# Altium schematic sheet IO_SCH3.SchDoc
size B; Organization: CWRUbotix; Address1: 10900 Euclid Avenue; Address2: Cleveland, OH 44106; Address3: USA
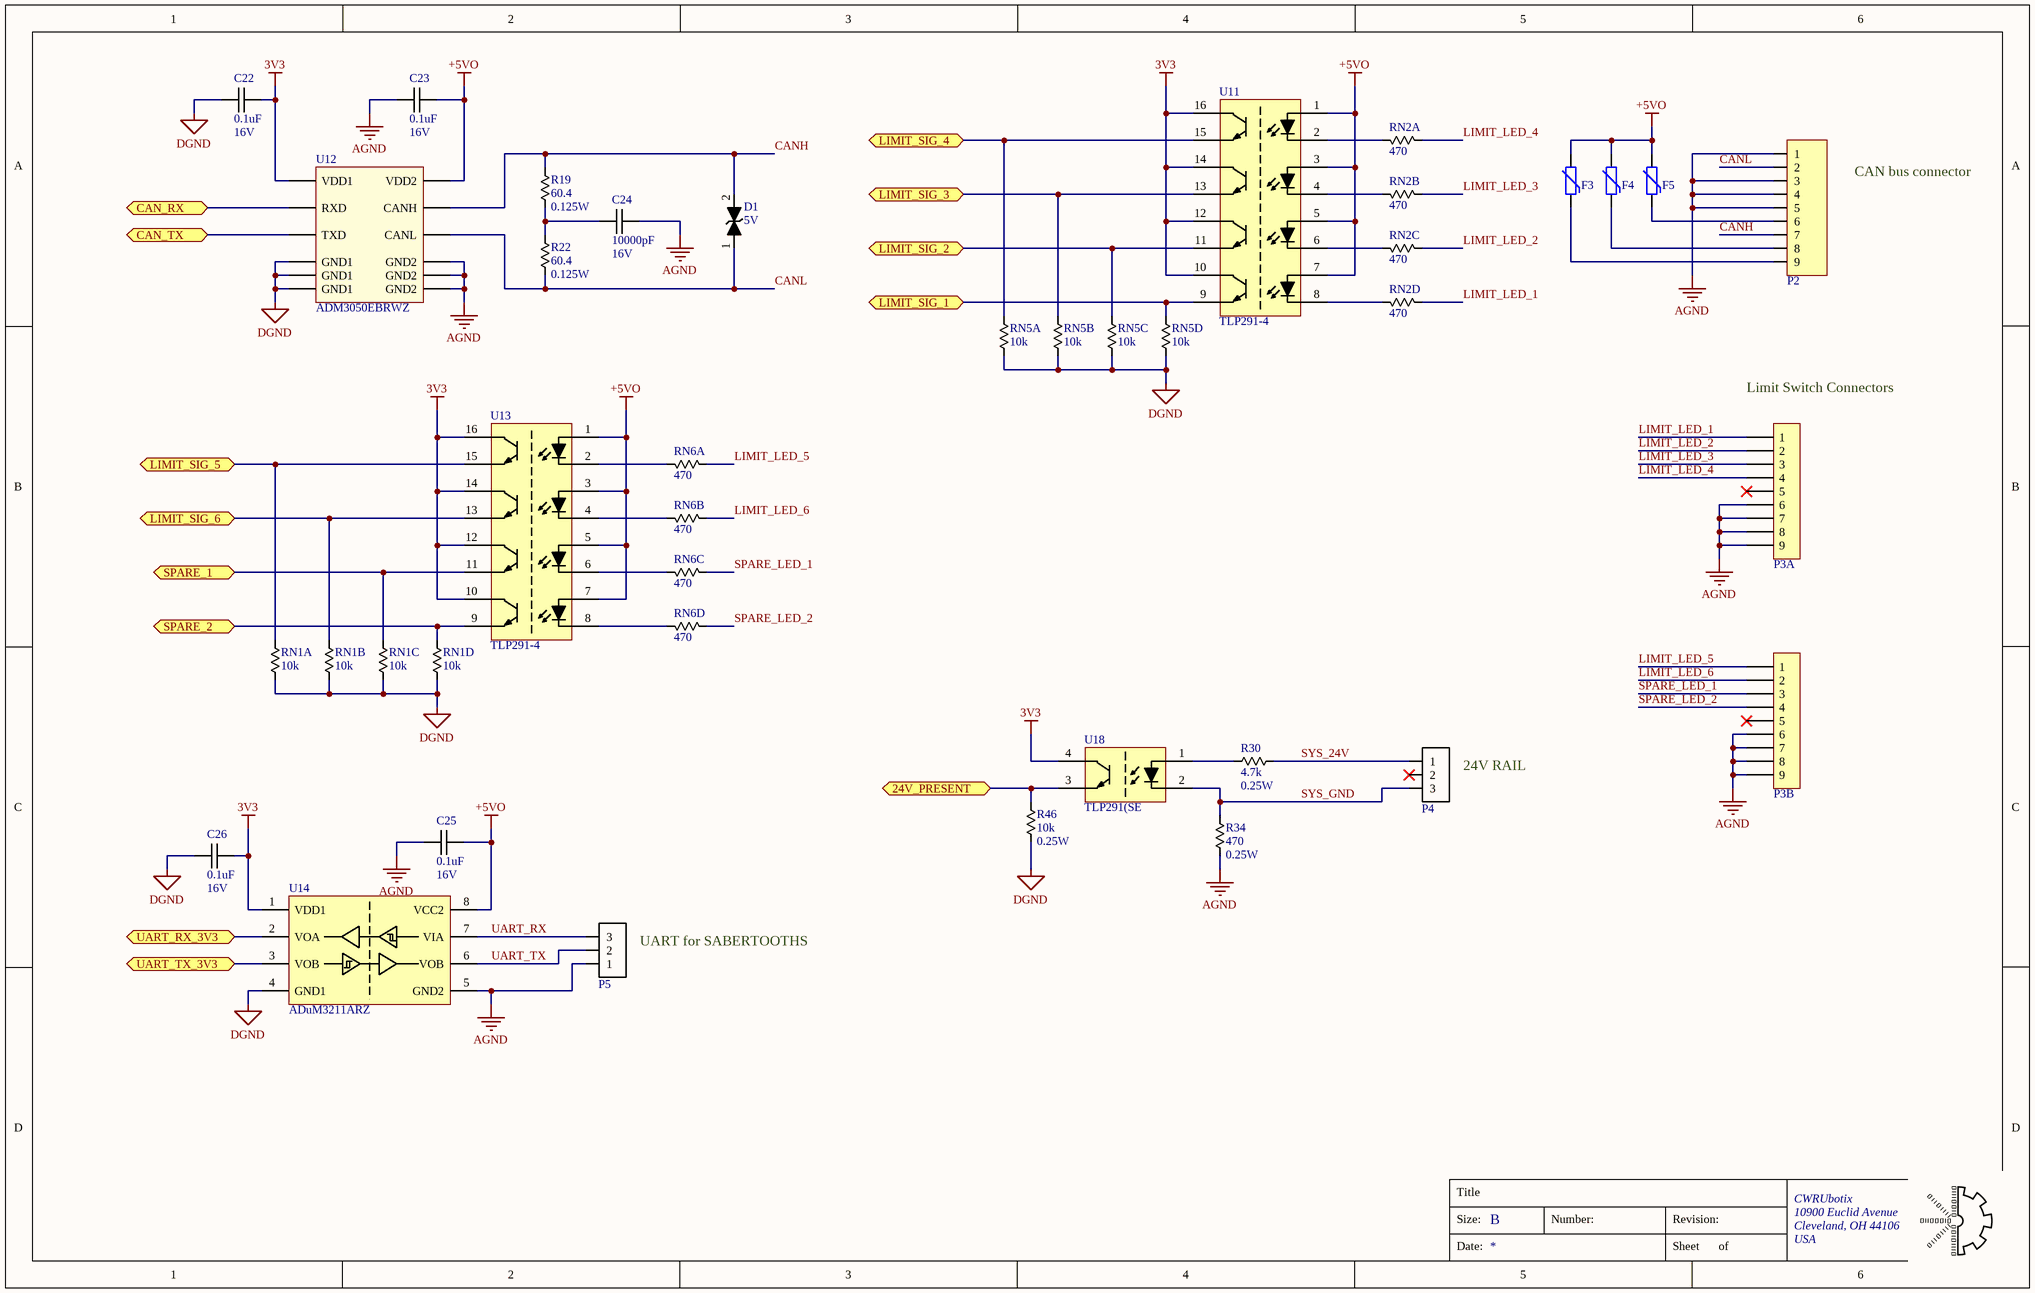
[diagram p0: IO_SCH3.SchDoc]

## Parts
C22  Capacitance: 0.1uF  Voltage Rating: 16V  [chip_0603]  (hidden comment: cap_single_np)
C23  Capacitance: 0.1uF  Voltage Rating: 16V  [chip_0603]  (hidden comment: cap_single_np)
C24  Capacitance: 10000pF  Voltage Rating: 16V  [chip_0603]  (hidden comment: cap_single_np)
C25  Capacitance: 0.1uF  Voltage Rating: 16V  [chip_0603]  (hidden comment: cap_single_np)
C26  Capacitance: 0.1uF  Voltage Rating: 16V  [chip_0603]  (hidden comment: cap_single_np)
D1  Reverse Breakdown Voltage: 5V  [do-214ac]  (hidden comment: diode_5)
F3  PTC_0  [chip_1206]  (value not drawn)
F4  PTC_0  [chip_1206]  (value not drawn)
F5  PTC_0  [chip_1206]  (value not drawn)
P2  conn-9x1_0  [182-009-213RYY1]  (value not drawn)
P3  conn-9x1_x2  [D_SUB_9x2_0]  (value not drawn)  (parts A,B of 2)
P4  conn-3x1_0  [JST_PHR_3_0]  (value not drawn)
P5  conn-3x1_0  [JST_PHR_3_0]  (value not drawn)
R19  Resistance: 60.4  Power Rating: 0.125W  [chip_0805]  (hidden comment: res_single)
R22  Resistance: 60.4  Power Rating: 0.125W  [chip_0805]  (hidden comment: res_single)
R30  Resistance: 4.7k  Power Rating: 0.25W  [chip_0603]  (hidden comment: res_single)
R34  Resistance: 470  Power Rating: 0.25W  [chip_0603]  (hidden comment: res_single)
R46  Resistance: 10k  Power Rating: 0.25W  [chip_0603]  (hidden comment: res_single)
RN1  Resistance: 10k  [chip_1206_arr]  (hidden comment: res_array_4)  (parts A,B,C,D of 4)
RN2  Resistance: 470  [chip_1206_arr]  (hidden comment: res_array_4)  (parts A,B,C,D of 4)
RN5  Resistance: 10k  [chip_1206_arr]  (hidden comment: res_array_4)  (parts A,B,C,D of 4)
RN6  Resistance: 470  [chip_1206_arr]  (hidden comment: res_array_4)  (parts A,B,C,D of 4)
U11  TLP291-4  [SO-16]
U12  Manufacturer PN: ADM3050EBRWZ  [SOW-16]  (hidden comment: ADM3050E)
U13  TLP291-4  [SO-16]
U14  Manufacturer PN: ADuM3211ARZ  [SO-8]  (hidden comment: ADuM3211)
U18  Manufacturer PN: TLP291(SE  [SO-4]  (hidden comment: opto_0)

## Ports
24V_PRESENT (bidir), CAN_RX (bidir), CAN_TX (bidir), LIMIT_SIG_1 (bidir), LIMIT_SIG_2 (bidir), LIMIT_SIG_3 (bidir), LIMIT_SIG_4 (bidir), LIMIT_SIG_5 (bidir), LIMIT_SIG_6 (bidir), SPARE_1 (bidir), SPARE_2 (bidir), UART_RX_3V3 (bidir), UART_TX_3V3 (bidir)

## Nets
3V3: C22.2 C26.2 U11.10 U11.12 U11.14 U11.16 U12.1(VDD1) U13.10 U13.12 U13.14 U13.16 U14.1(VDD1) U18.4(C)
+5VO: C23.1 C25.2 F3.2 F4.2 F5.2 U11.1 U11.3 U11.5 U11.7 U12.16(VDD2) U13.1 U13.3 U13.5 U13.7 U14.8(VCC2)
AGND: C23.2 C24.1 C25.1 P2.1 P2.3 P2.4 P2.5 P3.6 P3.7 P3.8 P3.9 P3.15(6) P3.16(7) P3.17(8) P3.18(9) P5.1 R34.1 U12.9(GND2) U12.10(GND2) U12.15(GND2) U14.5(GND2)
DGND: C22.1 C26.1 R46.2 RN1.5 RN1.6 RN1.7 RN1.8 RN5.5 RN5.6 RN5.7 RN5.8 U12.2(GND1) U12.7(GND1) U12.8(GND1) U14.4(GND1)
24V_PRESENT: R46.1 U18.3(E) ; port 24V_PRESENT
CAN_RX: U12.3(RXD) ; port CAN_RX
CAN_TX: U12.6(TXD) ; port CAN_TX
CANH: D1.2 P2.7 R19.1 U12.13(CANH)
CANL: D1.1 P2.2 R22.2 U12.12(CANL)
LIMIT_LED_1: P3.1 RN2.4
LIMIT_LED_2: P3.2 RN2.3
LIMIT_LED_3: P3.3 RN2.2
LIMIT_LED_4: P3.4 RN2.1
LIMIT_LED_5: P3.10(1) RN6.1
LIMIT_LED_6: P3.11(2) RN6.2
LIMIT_SIG_1: RN5.4 U11.9 ; port LIMIT_SIG_1
LIMIT_SIG_2: RN5.3 U11.11 ; port LIMIT_SIG_2
LIMIT_SIG_3: RN5.2 U11.13 ; port LIMIT_SIG_3
LIMIT_SIG_4: RN5.1 U11.15 ; port LIMIT_SIG_4
LIMIT_SIG_5: RN1.1 U13.15 ; port LIMIT_SIG_5
LIMIT_SIG_6: RN1.2 U13.13 ; port LIMIT_SIG_6
SPARE_1: RN1.3 U13.11 ; port SPARE_1
SPARE_2: RN1.4 U13.9 ; port SPARE_2
SPARE_LED_1: P3.12(3) RN6.3
SPARE_LED_2: P3.13(4) RN6.4
SYS_24V: P4.1 R30.2
SYS_GND: P4.3 R34.2 U18.2(A)
UART_RX: P5.3 U14.7(VIA)
UART_RX_3V3: U14.2(VOA) ; port UART_RX_3V3
UART_TX: P5.2 U14.6(VOB)
UART_TX_3V3: U14.3(VOB) ; port UART_TX_3V3
NetC24_2: C24.2 R19.2 R22.1
NetF3_1: F3.1 P2.9
NetF4_1: F4.1 P2.8
NetF5_1: F5.1 P2.6
NetR30_1: R30.1 U18.1(A)
NetRN2_5: RN2.5 U11.8
NetRN2_6: RN2.6 U11.6
NetRN2_7: RN2.7 U11.4
NetRN2_8: RN2.8 U11.2
NetRN6_5: RN6.5 U13.8
NetRN6_6: RN6.6 U13.6
NetRN6_7: RN6.7 U13.4
NetRN6_8: RN6.8 U13.2

Not connected (* = marked no-connect by the designer): P3 5* 14(5)*; P4 2*; U12 4(NC1) 5(NC2) 11(NC3) 14(NC4)

## Notes on the sheet
- CAN bus connector
- (near P3) Limit Switch Connectors
- (near P4) 24V RAIL
- (near P5) UART for SABERTOOTHS
- Title
- Size:
- B
- Number:
- Revision:
- Date:
- Sheet
- of

## Library data of the parts
C22 C23 C25 C26 = CAP-00542: CAP, 0.1uF, ±10%, 16V, X7R, 0603; Manufacturer: Murata; Tolerance: ±10%; Part Number: CAP-00542; Type: X7R
C24 = CAP-00543: CAP, 10000pF, ±10%, 16V, X7R, 0603; Tolerance: ±10%; Part Number: CAP-00543; Type: X7R
D1 = DIO-00036: TVS, 5V, 400W; Manufacturer: ST; Manufacturer PN: SMAJ5.0A-TR; Type: TVS; Part Number: DIO-00036; Power Rating: 400W
F3-F5 = MISC-00008: PTC Resettable fuse, 6V, 500mA, 1206; Manufacturer: Eaton; Manufacturer PN: PTS12066V050; TEMP_CO: *; Part Number: MISC-00008; Cost: 0.3
P2 = CONN-00035: D-Sub, 9-pin; Manufacturer: NorComp; Manufacturer PN: 182-009-213R561; Positions per level: 9; Levels: 1; Part Number: CONN-00035; Type: Thru-hole; Cost: 2.27; Weight: 8.89
P3 = CONN-00025: D-Sub, Dual 9-pin; Manufacturer PN: 178-009-513R571; Manufacturer: NorComp; Positions per level: 9; Levels: 2; Part Number: CONN-00025; Type: Thru-hole; Cost: 7.32; Weight: 22.69
P4 P5 = CONN-00047: JST PH 3x1, THT, 2.00mm Pitch; Manufacturer PN: B3B-PH-K; Positions per level: 3; Levels: 1; Part Number: CONN-00047; Type: Header; Manufacturer: JST; Cost: 0.19
R19 R22 = RES-00161: RES SMD 60.4 OHM 1% 1/8W 0805; Manufacturer: Rohm Semiconductor; Manufacturer PN: KTR10EZPF60R4; Tolerance: 1%; Part Number: RES-00161
R30 = RES-00470: RES SMD 4.7K OHM 1% 1/4W 0603; Manufacturer: Panasonic; Manufacturer PN: ERJ-PA3F4701V; Tolerance: 1%; Part Number: RES-00470
R34 = RES-00236: RES SMD 470 OHM 1% 1/4W 0603; Manufacturer: Panasonic; Manufacturer PN: ERJ-PA3F4700V; Tolerance: 1%; Part Number: RES-00236
R46 = RES-00306: RES SMD 10K OHM 1% 1/4W 0603; Manufacturer: Panasonic; Manufacturer PN: ERJ-PA3F1002V; Tolerance: 1%; Part Number: RES-00306; Cost: 0.144
RN1 RN5 = RES-00697: RES ARRAY 4 RES 10k OHM 5% 1/16W 1206; Manufacturer PN: 742C083103JP; Manufacturer: CTS Resistor Products; Power Rating: 1/16W; Part Number: RES-00697; Tolerance: 5%; Cost: 0.27
RN2 RN6 = RES-00698: RES ARRAY 4 RES 470 OHM 5% 1/16W 1206; Manufacturer PN: EXB-38V471JV; Manufacturer: Panasonic; Tolerance: 0.05; Power Rating: 1/16W; Part Number: RES-00698; Cost: 0.1
U11 U13 = IFACE-00012: Opto-Coupler Array, Photo-Transistor Output, TLP291-4; Manufacturer: Toshiba; Manufacturer PN: TLP291-4; Part Number: IFACE-00012
U12 = IFACE-00009: Isolated CANbus Transceiver, Single channel, ADM3050E; Manufacturer: Analog Devices; Part Number: IFACE-00009; Cost: 9.62
U14 = IFACE-00015: Digital Isolator, Dual-Channel, ADuM3211; Manufacturer: Analog Devices; Part Number: IFACE-00015; Cost: 2.87
U18 = ANLG-00049: IC, Opto-Coupler, 3750 Vrms, Wide SOIC-4, TLP291(SE; Manufacturer: Toshiba; Part Number: ANLG-00049; Cost: 0.45